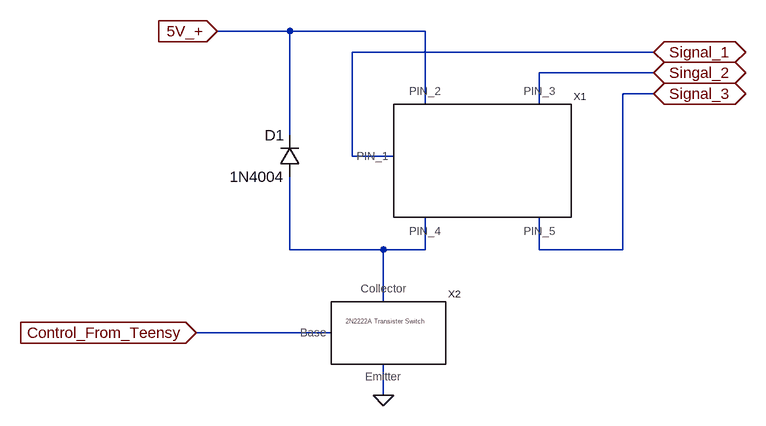
[diagram p0: schematic Relay_with_control.asc]
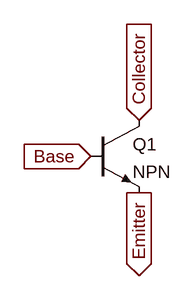
[diagram p1: sub-circuit transistor_switch_(poweramp_for_teensy_to_relay).asc]
Relay_with_control.asc, the LTspice schematic file:
Version 4
SHEET 1 880 680
WIRE -64 -16 -176 -16
WIRE 144 -16 -64 -16
WIRE 496 16 32 16
WIRE 496 48 320 48
WIRE 496 80 448 80
WIRE 144 96 144 -16
WIRE 320 96 320 48
WIRE -64 144 -64 -16
WIRE 32 176 32 16
WIRE 96 176 32 176
WIRE -64 320 -64 208
WIRE 80 320 -64 320
WIRE 144 320 144 272
WIRE 144 320 80 320
WIRE 320 320 320 272
WIRE 448 320 448 80
WIRE 448 320 320 320
WIRE 80 400 80 320
WIRE 0 448 -208 448
WIRE 80 544 80 496
FLAG -176 -16 5V_+
IOPIN -176 -16 In
FLAG -208 448 Control_From_Teensy
IOPIN -208 448 In
FLAG 496 16 Signal_1
IOPIN 496 16 BiDir
FLAG 496 48 Singal_2
IOPIN 496 48 BiDir
FLAG 496 80 Signal_3
IOPIN 496 80 BiDir
FLAG 80 544 0
SYMBOL Relay 272 224 R0
SYMATTR InstName X1
SYMBOL Transistor_switch_(powerAMP_for_Teensy_to_relay) 64 448 R0
SYMATTR InstName X2
SYMBOL diode -48 208 R180
WINDOW 0 24 64 Left 2
WINDOW 3 24 0 Left 2
SYMATTR InstName D1
SYMATTR Value 1N4004

transistor_switch_(poweramp_for_teensy_to_relay).asc, the sub-circuit schematic file:
Version 4
SHEET 1 880 680
FLAG 128 144 Base
IOPIN 128 144 In
FLAG 192 192 Emitter
IOPIN 192 192 Out
FLAG 192 96 Collector
IOPIN 192 96 In
SYMBOL npn 128 96 R0
SYMATTR InstName Q1

The netlist it stands for:
* Relay_with_control.asc
XX1 Signal_1 5V_+ Singal_2 N001 Signal_3 Relay  ; pins PIN_1 PIN_2 PIN_3 PIN_4 PIN_5
XX2 Control_From_Teensy N001 0 transistor_switch_(poweramp_for_teensy_to_relay)
D1 N001 5V_+ 1N4004

* block symbol definitions
.subckt transistor_switch_(poweramp_for_teensy_to_relay) Base Collector Emitter
Q1 Collector Base Emitter 0 NPN
.ends transistor_switch_(poweramp_for_teensy_to_relay)

.model D D
.lib standard.dio
.model NPN NPN
.model PNP PNP
.lib standard.bjt
.backanno
.end